# Altium schematic sheet 08_Power_Switch.SchDoc
size A4
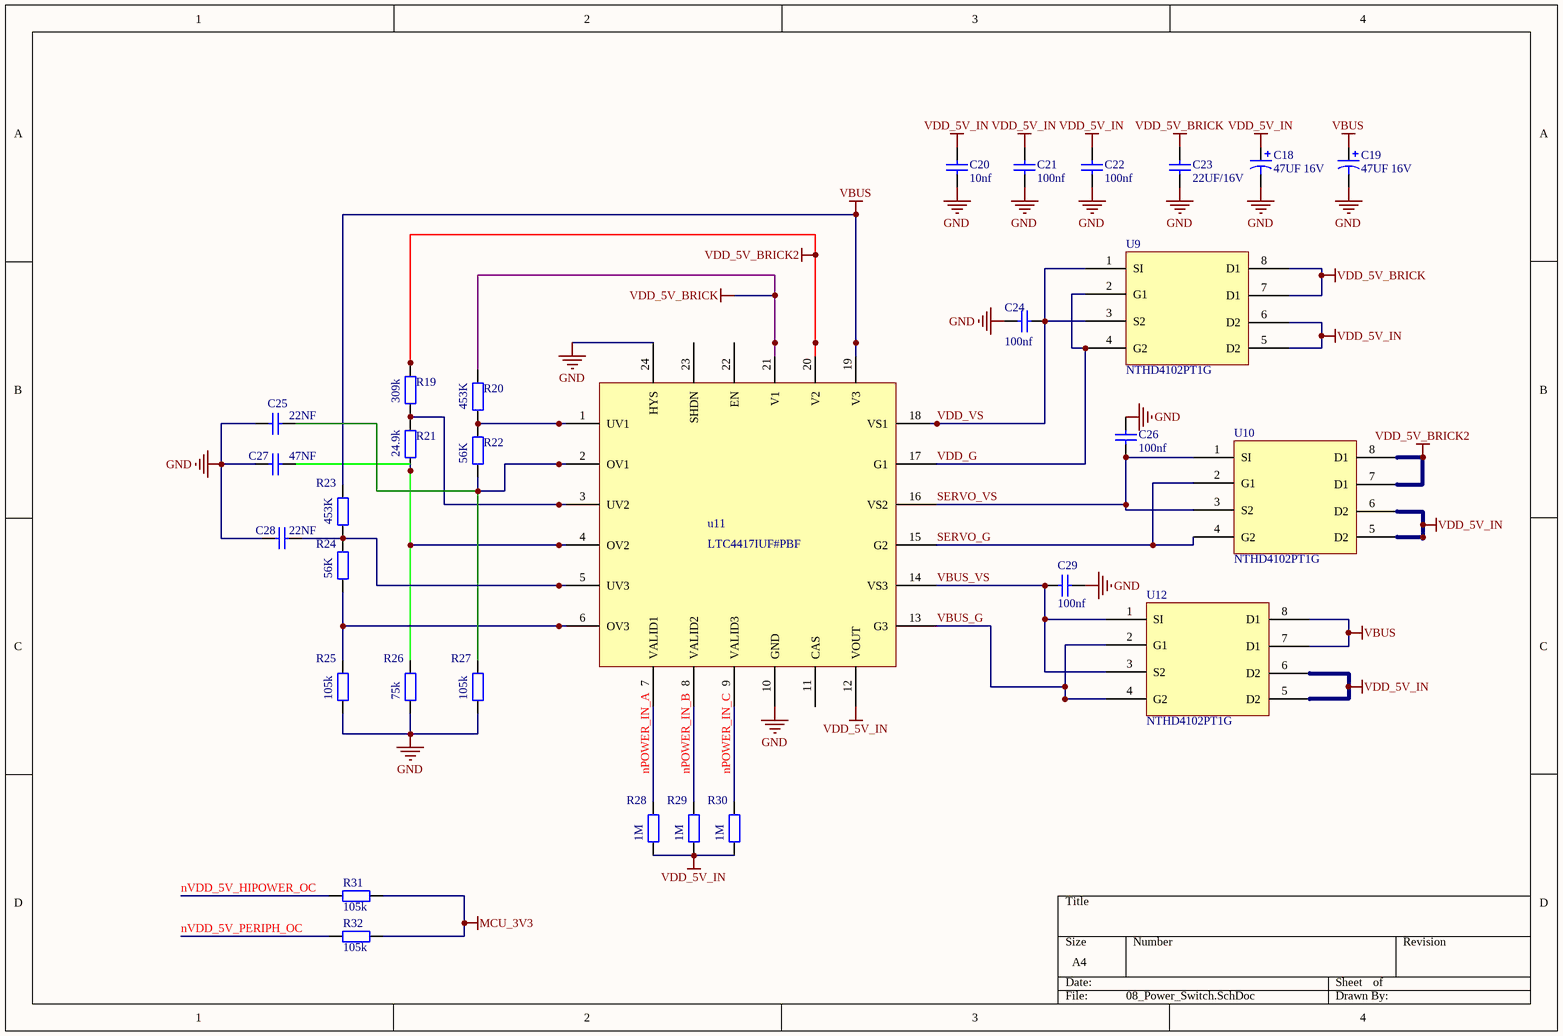
[diagram p0: 08_Power_Switch.SchDoc]

## Parts
C18  47UF 16V  [7343CAP]
C19  47UF 16V  [7343CAP]
C20  10nf  [0402CAP]
C21  100nf  [0402CAP]
C22  100nf  [0402CAP]
C23  22UF/16V  [0805CAP]
C24  100nf  [0402CAP]
C25  22NF  [0402CAP]
C26  100nf  [0402CAP]
C27  47NF  [0402CAP]
C28  22NF  [0402CAP]
C29  100nf  [0402CAP]
R19  309k  [R0402]
R20  453K  [R0402]
R21  24.9k  [R0402]
R22  56K  [R0402]
R23  453K  [R0402]
R24  56K  [R0402]
R25  105k  [R0402]
R26  75k  [R0402]
R27  105k  [R0402]
R28  1M  [R0402]
R29  1M  [R0402]
R30  1M  [R0402]
R31  105k  [R0402]
R32  105k  [R0402]
U9  NTHD4102PT1G  [1206-8]
U10  NTHD4102PT1G  [1206-8]
u11  LTC4417IUF#PBF  [QFN24]
U12  NTHD4102PT1G  [1206-8]

## Nets
GND: C18.C C19.C C20.1 C21.1 C22.1 C23.1 C24.2 C25.2 C26.2 C27.2 C28.2 C29.2 R25.1 R26.1 R27.1 u11.10(GND) u11.24(HYS)
MCU_3V3: R31.2 R32.2
VBUS: C19.A R23.2 u11.19(V3) U12.7(D1) U12.8(D1)
VDD_5V_BRICK: C23.2 R20.2 U9.7(D1) U9.8(D1) u11.21(V1)
VDD_5V_BRICK2: R19.2 U10.7(D1) U10.8(D1) u11.20(V2)
VDD_5V_IN: C18.A C20.2 C21.2 C22.2 R28.1 R29.1 R30.1 U9.5(D2) U9.6(D2) U10.5(D2) U10.6(D2) u11.12(VOUT) U12.5(D2) U12.6(D2)
nPOWER_IN_A: R28.2 u11.7(VALID1)
nPOWER_IN_B: R29.2 u11.8(VALID2)
nPOWER_IN_C: R30.2 u11.9(VALID3)
nVDD_5V_HIPOWER_OC: R31.1
nVDD_5V_PERIPH_OC: R32.1
SERVO_G: U10.2(G1) U10.4(G2) u11.15(G2)
SERVO_VS: C26.1 U10.1(SI) U10.3(S2) u11.16(VS2)
VBUS_G: u11.13(G3) U12.2(G1) U12.4(G2)
VBUS_VS: C29.1 u11.14(VS3) U12.1(SI) U12.3(S2)
VDD_G: U9.2(G1) U9.4(G2) u11.17(G1)
VDD_VS: C24.1 U9.1(SI) U9.3(S2) u11.18(VS1)
NetC25_1: C25.1 R22.1 R27.2 u11.2(OV1)
NetC27_1: C27.1 R21.1 R26.2 u11.4(OV2)
NetC28_1: C28.1 R23.1 R24.2 u11.5(UV3)
NetR19_1: R19.1 R21.2 u11.3(UV2)
NetR20_1: R20.1 R22.2 u11.1(UV1)
NetR24_1: R24.1 R25.2 u11.6(OV3)

Not connected (* = marked no-connect by the designer): u11 11(CAS) 22(EN) 23(SHDN)

## Library data of the parts
C18 C19 = Cap Pol1: Polarized Capacitor (Radial); Value: 100pF; Published: 8-Jun-2000; LatestRevisionDate: 17-Jul-2002; LatestRevisionNote: Re-released for DXP Platform.; PackageReference: RB7.6-15; Publisher: Altium Limited; PackageDescription: Polarized Capacitor (Radial); 2 Leads
C20-C29 = Cap: Value: 100pF; Published: 8-Jun-2000; LatestRevisionDate: 17-Jul-2002; LatestRevisionNote: Re-released for DXP Platform.; PackageReference: RAD-0.3; Publisher: Altium Limited; PackageDescription: Radial Cap, Thru-Hole; 2 Leads; 0.3 in Pin Spacing
R19-R32 = Res2: Resistor; Value: 1K; Published: 8-Jun-2000; LatestRevisionDate: 17-Jul-2002; LatestRevisionNote: Re-released for DXP Platform.; PackageReference: AXIAL-0.4; Publisher: Altium Limited; PackageDescription: Axial Device, Thru-Hole; 2 Leads; 0.4 in Pin Spacing